# Altium schematic sheet BDD_modul_ARM_v2.1_Sheet.SchDoc
size A0
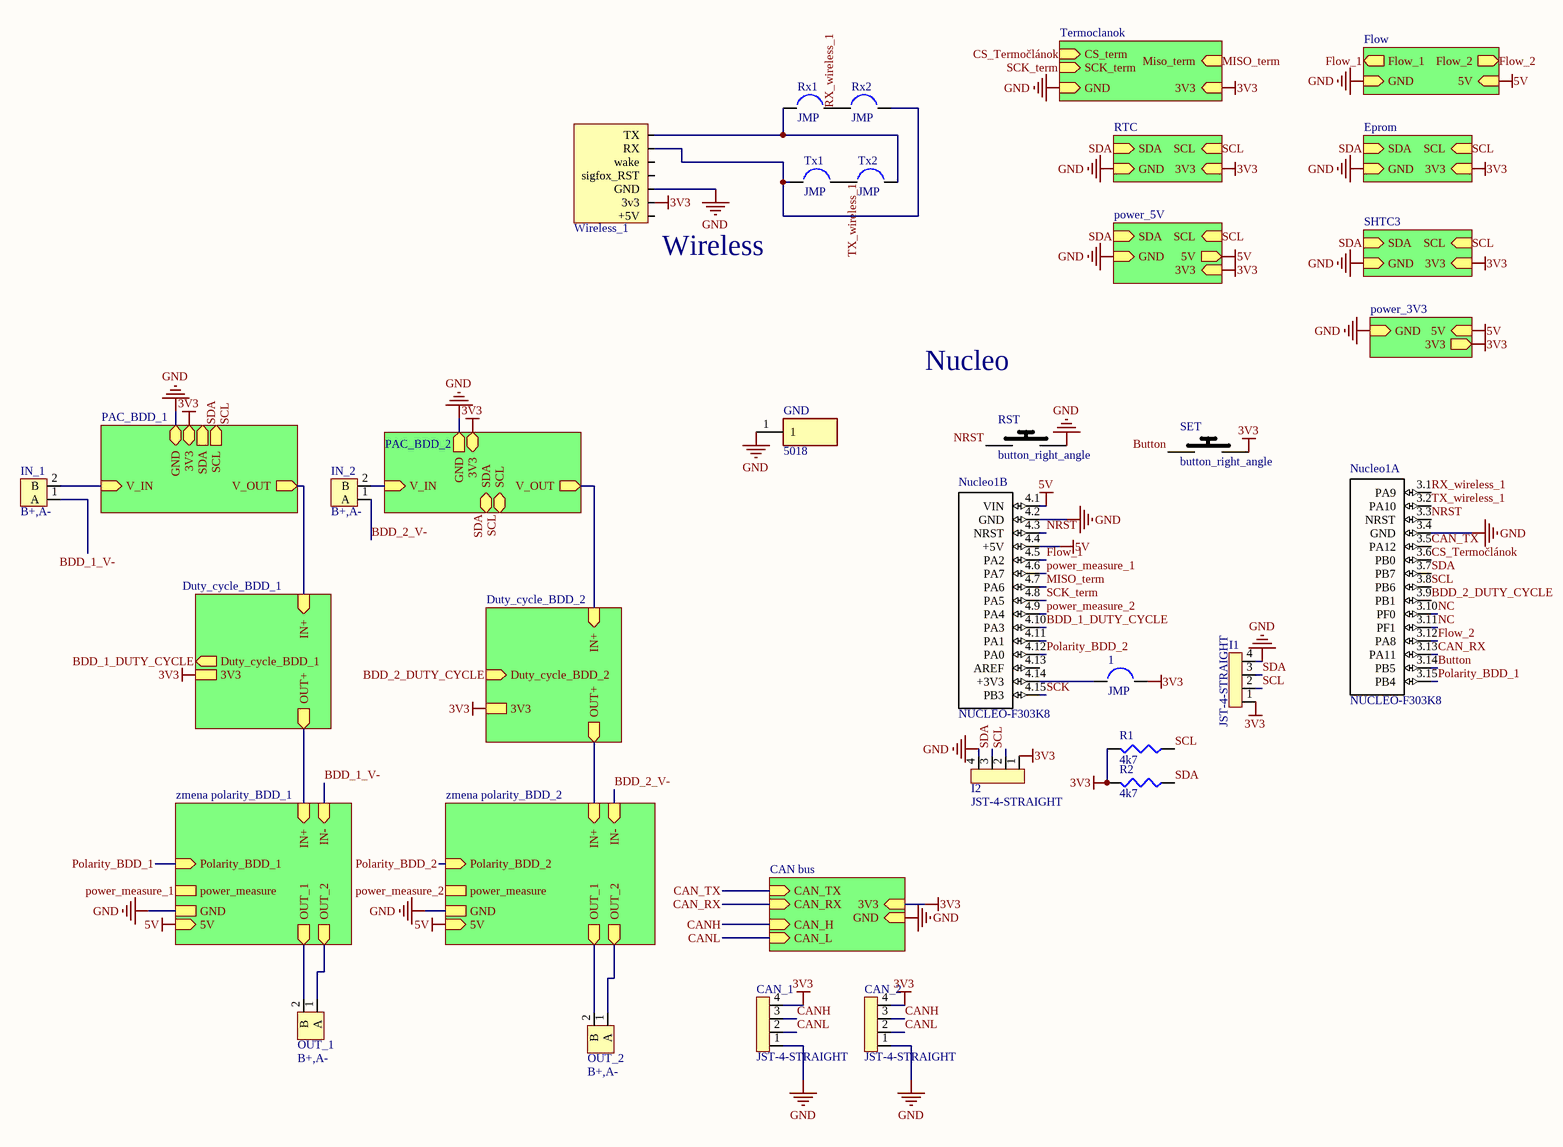
[diagram p0: BDD_modul_ARM_v2.1_Sheet.SchDoc]

## Parts
1  JMP  [JMP]
CAN_1  JST-4-STRAIGHT  [JST-4-STRAIGHT]
CAN_2  JST-4-STRAIGHT  [JST-4-STRAIGHT]
GND  5018  [1508000150000030]
I1  JST-4-STRAIGHT  [JST-4-STRAIGHT]
I2  JST-4-STRAIGHT  [JST-4-STRAIGHT]
IN_1  B+,A-  [CON_2CH_PLUG]
IN_2  B+,A-  [CON_2CH_PLUG]
Nucleo1  NUCLEO-F303K8  [*MODULE_NUCLEO-F303K8_NUCLEO-F303K8(Primary)]  (parts A,B of 2)
OUT_1  B+,A-  [CON_2CH_PLUG]
OUT_2  B+,A-  [CON_2CH_PLUG]
R1  4k7  [J1-0603]
R2  4k7  [J1-0603]
RST  button_right_angle  [1825027-8]
Rx1  JMP  [JMP]
Rx2  JMP  [JMP]
SET  button_right_angle  [1825027-8]
Tx1  JMP  [JMP]
Tx2  JMP  [JMP]
Wireless_1  header7  [Wireless]  (value not drawn)

## Sub-sheets
Designator = CAN bus: 3V3 (in), CAN_TX (in), CAN_RX (in), GND (in), CAN_H (in), CAN_L (in)
Duty_cycle_BDD_1 = Duty_cycle_BDD_1: IN+ (in), OUT+ (out), Duty_cycle_BDD_1 (out), 3V3
Duty_cycle_BDD_2 = Duty_cycle_BDD_2: IN+ (in), OUT+ (out), Duty_cycle_BDD_2 (in), 3V3
Eprom = Eprom: 3V3 (in), GND (in), SDA (in), SCL (in)
Flow = Flow: GND (in), Flow_1 (out), Flow_2 (out), 5V (in)
PAC_BDD_1 = PAC_BDD_1: GND (bidir), 3V3 (bidir), V_IN (in), V_OUT (out), SDA (out), SCL (out)
PAC_BDD_2 = PAC_BDD_2: 3V3 (bidir), SDA (bidir), SCL (bidir), V_IN (in), V_OUT (out), GND (out)
polarita_BDD_1 = zmena polarity_BDD_1: Polarity_BDD_1 (in), IN+ (in), IN- (in), OUT_1 (out), OUT_2 (out), power_measure, GND, 5V (in)
polarita_BDD_2 = zmena polarity_BDD_2: Polarity_BDD_2 (in), IN+ (in), IN- (in), OUT_1 (out), OUT_2 (out), power_measure, GND, 5V (in)
power_3V3 = power_3V3: 5V (in), 3V3 (out), GND (in)
power_5V = power_5V: 5V (out), GND (in), SDA (in), SCL (in), 3V3 (in)
RTC = RTC: 3V3 (in), GND (in), SCL (in), SDA (in)
SHTC3 = SHTC3: SCL (in), SDA (in), GND (in), 3V3 (in)
Termoclanok = Termoclanok: 3V3 (in), Miso_term (in), GND (in), CS_term (in), SCK_term (in)

## Nets
3V3: 1.2 CAN_1.4 CAN_2.4 I1.1 I2.1 R1.2 R2.2 SET.2 Wireless_1.2(3v3) ; sheet Duty_cycle_BDD_1/3V3, sheet PAC_BDD_1/3V3, sheet Duty_cycle_BDD_2/3V3, sheet PAC_BDD_2/3V3, sheet Designator/3V3, sheet Eprom/3V3, sheet Termoclanok/3V3, sheet SHTC3/3V3, sheet power_5V/3V3, sheet power_3V3/3V3, sheet RTC/3V3
5V: Nucleo1.4.1(VIN) Nucleo1.4.4(+5V) ; sheet polarita_BDD_1/5V, sheet polarita_BDD_2/5V, sheet Flow/5V, sheet power_5V/5V, sheet power_3V3/5V
GND: CAN_1.1 CAN_2.1 GND.1 I1.4 I2.4 Nucleo1.3.4(GND) Nucleo1.4.2(GND) RST.2 Wireless_1.3(GND) ; sheet polarita_BDD_1/GND, sheet polarita_BDD_2/GND, sheet PAC_BDD_1/GND, sheet PAC_BDD_2/GND, sheet Designator/GND, sheet Flow/GND, sheet Eprom/GND, sheet Termoclanok/GND, sheet SHTC3/GND, sheet power_5V/GND, sheet power_3V3/GND, sheet RTC/GND
BDD_1_DUTY_CYCLE: Nucleo1.4.10(PA3) ; sheet Duty_cycle_BDD_1/Duty_cycle_BDD_1
BDD_1_V-: IN_1.1(A) ; sheet polarita_BDD_1/IN-
BDD_2_DUTY_CYCLE: Nucleo1.3.9(PB1) ; sheet Duty_cycle_BDD_2/Duty_cycle_BDD_2
BDD_2_V-: IN_2.1(A) ; sheet polarita_BDD_2/IN-
Button: Nucleo1.3.14(PB5) SET.1
CAN_RX: Nucleo1.3.13(PA11) ; sheet Designator/CAN_RX
CAN_TX: Nucleo1.3.5(PA12) ; sheet Designator/CAN_TX
CANH: CAN_1.3 CAN_2.3 ; sheet Designator/CAN_H
CANL: CAN_1.2 CAN_2.2 ; sheet Designator/CAN_L
CS_Termočlánok: Nucleo1.3.6(PB0) ; sheet Termoclanok/CS_term
Flow_1: Nucleo1.4.5(PA2) ; sheet Flow/Flow_1
Flow_2: Nucleo1.3.12(PA8) ; sheet Flow/Flow_2
MISO_term: Nucleo1.4.7(PA6) ; sheet Termoclanok/Miso_term
NC: Nucleo1.3.10(PF0) Nucleo1.3.11(PF1)
NRST: Nucleo1.3.3(NRST) Nucleo1.4.3(NRST) RST.1
Polarity_BDD_1: Nucleo1.3.15(PB4) ; sheet polarita_BDD_1/Polarity_BDD_1
Polarity_BDD_2: Nucleo1.4.12(PA0) ; sheet polarita_BDD_2/Polarity_BDD_2
power_measure_1: Nucleo1.4.6(PA7) ; sheet polarita_BDD_1/power_measure
power_measure_2: Nucleo1.4.9(PA4) ; sheet polarita_BDD_2/power_measure
RX_wireless_1: Nucleo1.3.1(PA9) Rx1.2 Rx2.1
SCK: Nucleo1.4.15(PB3)
SCK_term: Nucleo1.4.8(PA5) ; sheet Termoclanok/SCK_term
SCL: I1.2 I2.2 Nucleo1.3.8(PB6) R1.1 ; sheet PAC_BDD_1/SCL, sheet PAC_BDD_2/SCL, sheet Eprom/SCL, sheet SHTC3/SCL, sheet power_5V/SCL, sheet RTC/SCL
SDA: I1.3 I2.3 Nucleo1.3.7(PB7) R2.1 ; sheet PAC_BDD_1/SDA, sheet PAC_BDD_2/SDA, sheet Eprom/SDA, sheet SHTC3/SDA, sheet power_5V/SDA, sheet RTC/SDA
TX_wireless_1: Nucleo1.3.2(PA10) Tx1.2 Tx2.1
Net1_1: 1.1 Nucleo1.4.14(+3V3)
NetIN_1_2: IN_1.2(B) ; sheet PAC_BDD_1/V_IN
NetIN_2_2: IN_2.2(B) ; sheet PAC_BDD_2/V_IN
NetOUT_1_1: OUT_1.1(A) ; sheet polarita_BDD_1/OUT_2
NetOUT_1_2: OUT_1.2(B) ; sheet polarita_BDD_1/OUT_1
NetOUT_2_1: OUT_2.1(A) ; sheet polarita_BDD_2/OUT_2
NetOUT_2_2: OUT_2.2(B) ; sheet polarita_BDD_2/OUT_1
NetRx1_1: Rx1.1 Tx2.2 Wireless_1.7(TX)
NetRx2_2: Rx2.2 Tx1.1 Wireless_1.6(RX)
(unnamed): sheet polarita_BDD_1/IN+, sheet Duty_cycle_BDD_1/OUT+
(unnamed): sheet polarita_BDD_2/IN+, sheet Duty_cycle_BDD_2/OUT+
(unnamed): sheet Duty_cycle_BDD_1/IN+, sheet PAC_BDD_1/V_OUT
(unnamed): sheet Duty_cycle_BDD_2/IN+, sheet PAC_BDD_2/V_OUT

Not connected (* = marked no-connect by the designer): Nucleo1 4.11(PA1) 4.13(AREF); Wireless_1 1(+5V) 4(sigfox_RST) 5(wake)

## Notes on the sheet
- (near Wireless_1) Wireless
- Nucleo

## Library data of the parts
CAN_1 CAN_2 I1 I2 = JST-4-STRAIGHT: B4B-PH-K-S
GND = 5018: Test Point; Manufacturer_Name: Keystone Electronics; Allied_Number: 71078148; Datasheet Link: https://www.keyelco.com/product-pdf.cfm?p=1356; Height: 2.29mm; Manufacturer_Part_Number: 5018; Mouser Part Number: 534-5018; Mouser Price/Stock: https://www.mouser.com/Search/Refine.aspx?Keyword=534-5018; Allied Price/Stock: https://www.alliedelec.com/keystone-electronics-5018/71078148/
IN_1 IN_2 OUT_1 OUT_2 = CON_2CH_PLUG: TBG-5.0-KW-2P
Nucleo1 = NUCLEO-F303K8: STM32 Nucleo-32 development board with STM32F303K8T6 MCU, supports Arduino connectivity; MF: STMicroelectronics; MP: NUCLEO-F303K8; Price: None; SnapEDA_Link: https://www.snapeda.com/parts/NUCLEO-F303K8/STMicroelectronics/view-part/?ref=snap; Availability: Unavailable; Package: None; Value: *
R1 R2 = Res3: Resistor; Value: 1K5; Published: 8-Jun-2000; LatestRevisionDate: 29-May-2009; LatestRevisionNote: IPC-7351 Footprint Added.; PackageReference: J1-0603; Publisher: Altium Limited; PackageDescription: Chip Resistor
RST SET = button_right_angle: Switch; Manufacturer_Name: TE Connectivity; Datasheet Link: http://www.te.com/commerce/DocumentDelivery/DDEController?Action=srchrtrv&DocNm=1825027&DocType=Customer+Drawing&DocLang=English; Manufacturer_Part_Number: 1825027-8; Mouser Part Number: 506-1825027-8; Mouser Price/Stock: https://www.mouser.com/Search/Refine.aspx?Keyword=506-1825027-8; RS Part Number: 7182389P; RS Price/Stock: http://uk.rs-online.com/web/p/products/7182389P
Wireless_1 = Wireless